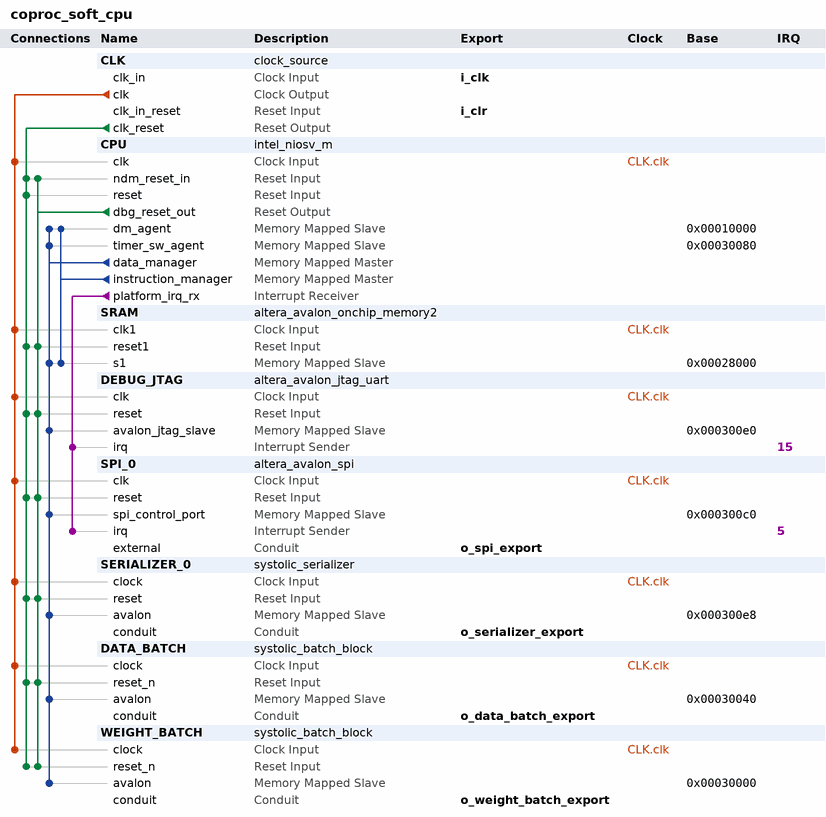
[diagram p0: system contents]
# Platform Designer (Qsys) system coproc_soft_cpu, Cyclone IV E EP4CE6E22C8
# Parameters at their usual value, and those the tool derives, are not listed.
package require -exact qsys 24.1
create_system coproc_soft_cpu
set_project_property DEVICE_FAMILY {Cyclone IV E}
set_project_property DEVICE EP4CE6E22C8

add_instance CLK clock_source 24.1
set_instance_parameter_value CLK clockFrequency 100000000

add_instance CPU intel_niosv_m 26.0.0
set_instance_parameter_value CPU clockFrequency 100000000
set_instance_parameter_value CPU enableAvalonInterface true
set_instance_parameter_value CPU enableDebugReset true
set_instance_parameter_value CPU enableECCLite false
set_instance_parameter_value CPU hartId 0
set_instance_parameter_value CPU interruptMode 0
set_instance_parameter_value CPU pipelineArch true
set_instance_parameter_value CPU resetSlave SRAM.s1

add_instance SRAM altera_avalon_onchip_memory2 24.1
set_instance_parameter_value SRAM dataWidth 32
set_instance_parameter_value SRAM dualPort false
set_instance_parameter_value SRAM initMemContent true
set_instance_parameter_value SRAM initializationFileName /home/notforest/Documents/fpga-coprocessor-nios2/src/soft_cpu/software/firmware/SRAM.hex
set_instance_parameter_value SRAM memorySize 20480
set_instance_parameter_value SRAM useNonDefaultInitFile true

add_instance DEBUG_JTAG altera_avalon_jtag_uart 24.1
set_instance_parameter_value DEBUG_JTAG printingMethod true
set_instance_parameter_value DEBUG_JTAG simInteractiveOptions NO_INTERACTIVE_WINDOWS

add_instance SPI_0 altera_avalon_spi 24.1
set_instance_parameter_value SPI_0 clockPhase 1
set_instance_parameter_value SPI_0 clockPolarity 1
set_instance_parameter_value SPI_0 dataWidth 8
set_instance_parameter_value SPI_0 insertSync true
set_instance_parameter_value SPI_0 masterSPI false
set_instance_parameter_value SPI_0 numberOfSlaves 1
set_instance_parameter_value SPI_0 targetClockRate 128000

add_instance SERIALIZER_0 systolic_serializer 1.0

add_instance DATA_BATCH systolic_batch_block 1.0
set_instance_parameter_value DATA_BATCH g_DIMENSION 8

add_instance WEIGHT_BATCH systolic_batch_block 1.0
set_instance_parameter_value WEIGHT_BATCH g_DIMENSION 8

# connections
add_connection CLK.clk CPU.clk clock
add_connection CLK.clk DATA_BATCH.clock clock
add_connection CLK.clk DEBUG_JTAG.clk clock
add_connection CLK.clk SERIALIZER_0.clock clock
add_connection CLK.clk SPI_0.clk clock
add_connection CLK.clk SRAM.clk1 clock
add_connection CLK.clk WEIGHT_BATCH.clock clock
add_connection CLK.clk_reset CPU.ndm_reset_in reset
add_connection CLK.clk_reset CPU.reset reset
add_connection CLK.clk_reset DATA_BATCH.reset_n reset
add_connection CLK.clk_reset DEBUG_JTAG.reset reset
add_connection CLK.clk_reset SERIALIZER_0.reset reset
add_connection CLK.clk_reset SPI_0.reset reset
add_connection CLK.clk_reset SRAM.reset1 reset
add_connection CLK.clk_reset WEIGHT_BATCH.reset_n reset
add_connection CPU.dbg_reset_out CPU.ndm_reset_in reset
add_connection CPU.dbg_reset_out DATA_BATCH.reset_n reset
add_connection CPU.dbg_reset_out DEBUG_JTAG.reset reset
add_connection CPU.dbg_reset_out SERIALIZER_0.reset reset
add_connection CPU.dbg_reset_out SPI_0.reset reset
add_connection CPU.dbg_reset_out SRAM.reset1 reset
add_connection CPU.dbg_reset_out WEIGHT_BATCH.reset_n reset
add_connection CPU.data_manager CPU.dm_agent avalon
set_connection_parameter_value CPU.data_manager/CPU.dm_agent baseAddress 0x00010000
add_connection CPU.data_manager CPU.timer_sw_agent avalon
set_connection_parameter_value CPU.data_manager/CPU.timer_sw_agent baseAddress 0x00030080
add_connection CPU.data_manager DATA_BATCH.avalon avalon
set_connection_parameter_value CPU.data_manager/DATA_BATCH.avalon baseAddress 0x00030040
add_connection CPU.data_manager DEBUG_JTAG.avalon_jtag_slave avalon
set_connection_parameter_value CPU.data_manager/DEBUG_JTAG.avalon_jtag_slave baseAddress 0x000300e0
add_connection CPU.data_manager SERIALIZER_0.avalon avalon
set_connection_parameter_value CPU.data_manager/SERIALIZER_0.avalon baseAddress 0x000300e8
add_connection CPU.data_manager SPI_0.spi_control_port avalon
set_connection_parameter_value CPU.data_manager/SPI_0.spi_control_port baseAddress 0x000300c0
add_connection CPU.data_manager SRAM.s1 avalon
set_connection_parameter_value CPU.data_manager/SRAM.s1 baseAddress 0x00028000
add_connection CPU.data_manager WEIGHT_BATCH.avalon avalon
set_connection_parameter_value CPU.data_manager/WEIGHT_BATCH.avalon baseAddress 0x00030000
add_connection CPU.instruction_manager CPU.dm_agent avalon
set_connection_parameter_value CPU.instruction_manager/CPU.dm_agent baseAddress 0x00010000
add_connection CPU.instruction_manager SRAM.s1 avalon
set_connection_parameter_value CPU.instruction_manager/SRAM.s1 baseAddress 0x00028000
add_connection CPU.platform_irq_rx DEBUG_JTAG.irq interrupt
set_connection_parameter_value CPU.platform_irq_rx/DEBUG_JTAG.irq irqNumber 15
add_connection CPU.platform_irq_rx SPI_0.irq interrupt
set_connection_parameter_value CPU.platform_irq_rx/SPI_0.irq irqNumber 5

# exported interfaces
add_interface i_clk clock sink
set_interface_property i_clk EXPORT_OF CLK.clk_in
add_interface i_clr reset sink
set_interface_property i_clr EXPORT_OF CLK.clk_in_reset
add_interface o_data_batch_export conduit end
set_interface_property o_data_batch_export EXPORT_OF DATA_BATCH.conduit
add_interface o_serializer_export conduit end
set_interface_property o_serializer_export EXPORT_OF SERIALIZER_0.conduit
add_interface o_spi_export conduit end
set_interface_property o_spi_export EXPORT_OF SPI_0.external
add_interface o_weight_batch_export conduit end
set_interface_property o_weight_batch_export EXPORT_OF WEIGHT_BATCH.conduit

set_interconnect_requirement {$system} qsys_mm.clockCrossingAdapter HANDSHAKE
set_interconnect_requirement {$system} qsys_mm.enableEccProtection FALSE
set_interconnect_requirement {$system} qsys_mm.insertDefaultSlave FALSE
set_interconnect_requirement {$system} qsys_mm.maxAdditionalLatency 1

save_system coproc_soft_cpu.qsys
